# Altium schematic sheet Atmega8.SchDoc
size A
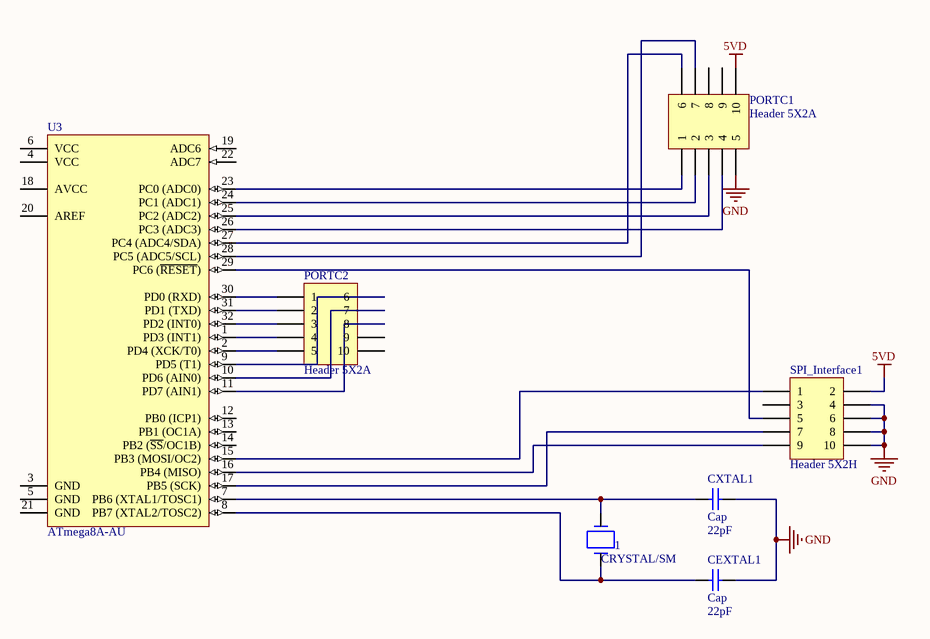
[diagram p0: Atmega8.SchDoc]

## Parts
1  CRYSTAL/SM
CEXTAL1  Cap  value 22pF  [CAPC2012X09M]
CXTAL1  Cap  value 22pF  [CAPC2012X09M]
PORTC1  Header 5X2A  [HDR2X5_CEN]
PORTC2  Header 5X2A  [HDR2X5_CEN]
SPI_Interface1  Header 5X2H  [HDR2X5H]
U3  ATmega8A-AU  [32A_N]

## Nets
5VD: PORTC1.10 SPI_Interface1.2
GND: CEXTAL1.1 CXTAL1.1 PORTC1.5 SPI_Interface1.4 SPI_Interface1.6 SPI_Interface1.8 SPI_Interface1.10
Net1_1: 1.1 CXTAL1.2 U3.7(PB6_(XTAL1/TOSC1))
Net1_2: 1.2 CEXTAL1.2 U3.8(PB7_(XTAL2/TOSC2))
NetPORTC1_1: PORTC1.1 U3.23(PC0_(ADC0))
NetPORTC1_2: PORTC1.2 U3.24(PC1_(ADC1))
NetPORTC1_3: PORTC1.3 U3.25(PC2_(ADC2))
NetPORTC1_4: PORTC1.4 U3.26(PC3_(ADC3))
NetPORTC1_6: PORTC1.6 U3.27(PC4_(ADC4/SDA))
NetPORTC1_7: PORTC1.7 U3.28(PC5_(ADC5/SCL))
NetPORTC2_1: PORTC2.1 U3.30(PD0_(RXD))
NetPORTC2_2: PORTC2.2 U3.31(PD1_(TXD))
NetPORTC2_3: PORTC2.3 U3.32(PD2_(INT0))
NetPORTC2_4: PORTC2.4 U3.1(PD3_(INT1))
NetPORTC2_5: PORTC2.5 U3.2(PD4_(XCK/T0))
NetPORTC2_6: PORTC2.6 U3.9(PD5_(T1))
NetPORTC2_7: PORTC2.7 U3.10(PD6_(AIN0))
NetPORTC2_8: PORTC2.8 U3.11(PD7_(AIN1))
NetSPI_Interface1_1: SPI_Interface1.1 U3.15(PB3_(MOSI/OC2))
NetSPI_Interface1_5: SPI_Interface1.5 U3.29(PC6_(~{RESET}))
NetSPI_Interface1_7: SPI_Interface1.7 U3.17(PB5_(SCK))
NetSPI_Interface1_9: SPI_Interface1.9 U3.16(PB4_(MISO))

Not connected (* = marked no-connect by the designer): PORTC1 8 9; PORTC2 9 10; SPI_Interface1 3; U3 3(GND) 4(VCC) 5(GND) 6(VCC) 12(PB0_(ICP1)) 13(PB1_(OC1A)) 14(PB2_(~{SS}/OC1B)) 18(AVCC) 19(ADC6) 20(AREF) 21(GND) 22(ADC7)

## Library data of the parts
CEXTAL1 CXTAL1 = CAP-X7R-22pF-630V-±10%: CAP CER 22pF 630v X7R 0805; MPN: C0805C220KBRACTU; PN: 399-5568-1-ND; Name: CAP-X7R-22pF-630V-±10%; URL: http://www.digikey.ca/product-detail/en/C0805C220KBRACTU/399-5568-1-ND
PORTC1 PORTC2 = Header 5X2A: Header, 5-Pin, Dual row; LatestRevisionDate: 17-Jul-2002; LatestRevisionNote: Re-released for DXP Platform.; Publisher: Altium Limited
SPI_Interface1 = Header 5X2H: Header, 5-Pin, Dual row, Right Angle; LatestRevisionDate: 17-Jul-2002; LatestRevisionNote: Re-released for DXP Platform.; Publisher: Altium Limited
U3 = ATmega8A-AU: 8-bit AVR Microcontroller, 8KB Flash, 512 Bytes EEPROM, 1KB SRAM, 32-pin TQFP, Industrial Grade (-40°C to 85°C); Published: 1-Apr-2010; DatasheetVersion: revC, Jul-2009; PackageVersion: revB, Oct-2001; PackageReference: 32A; Publisher: Altium Limited; PackageDescription: 32-Lead, 7x7x1.0 mm Body, 0.8mm Lead Pitch, Thin Profile Plastic Quad Flat Package (TQFP); Supplier 1: Digi-Key; Supplier Part Number 1: ATMEGA8A-AU-ND; Supplier 2: Farnell; Supplier Part Number 2: 1748532; Supplier 3: Mouser; Supplier Part Number 3: 556-ATMEGA8A-AU; Code_JEDEC: MS-026-ABA; ComponentLink1Description: Manufacturer Link; ComponentLink1URL: http://www.atmel.com/products/avr/default.asp?; ComponentLink2Description: ATmega8A Datasheet; ComponentLink2URL: http://www.atmel.com/dyn/resources/prod_documents/doc8159.pdf; ComponentLink3Description: ATmega8A Summary; ComponentLink3URL: http://www.atmel.com/dyn/resources/prod_documents/8159S.pdf; ComponentLink4Description: Atmel.com Home; ComponentLink4URL: http://www.atmel.com